# EAGLE schematic main (EAGLE 6.1)
ESKD_COPYRIGHT: 50|48|48|56|48|48; ESKD_DATE1: 51|49|46|49|50|46|50|48|49|48; ESKD_DESCRIPTION1: 210|229|240|236|238|241|242|224|242; ESKD_DESCRIPTION2: 241|245|229|236|224|32|253|235|229|234|242|240|232|247|229|241|234|224|255; ESKD_DESCRIPTION3: 239|240|232|237|246|232|239|232|224|235|252|237|224|255; ESKD_NUMBER: 192|193|194|195|32|49|57|52|48|48|48|46|48|48|49|32|221|51; ESKD_NUMBER_SHEET: 49; ESKD_SHEETS: 49
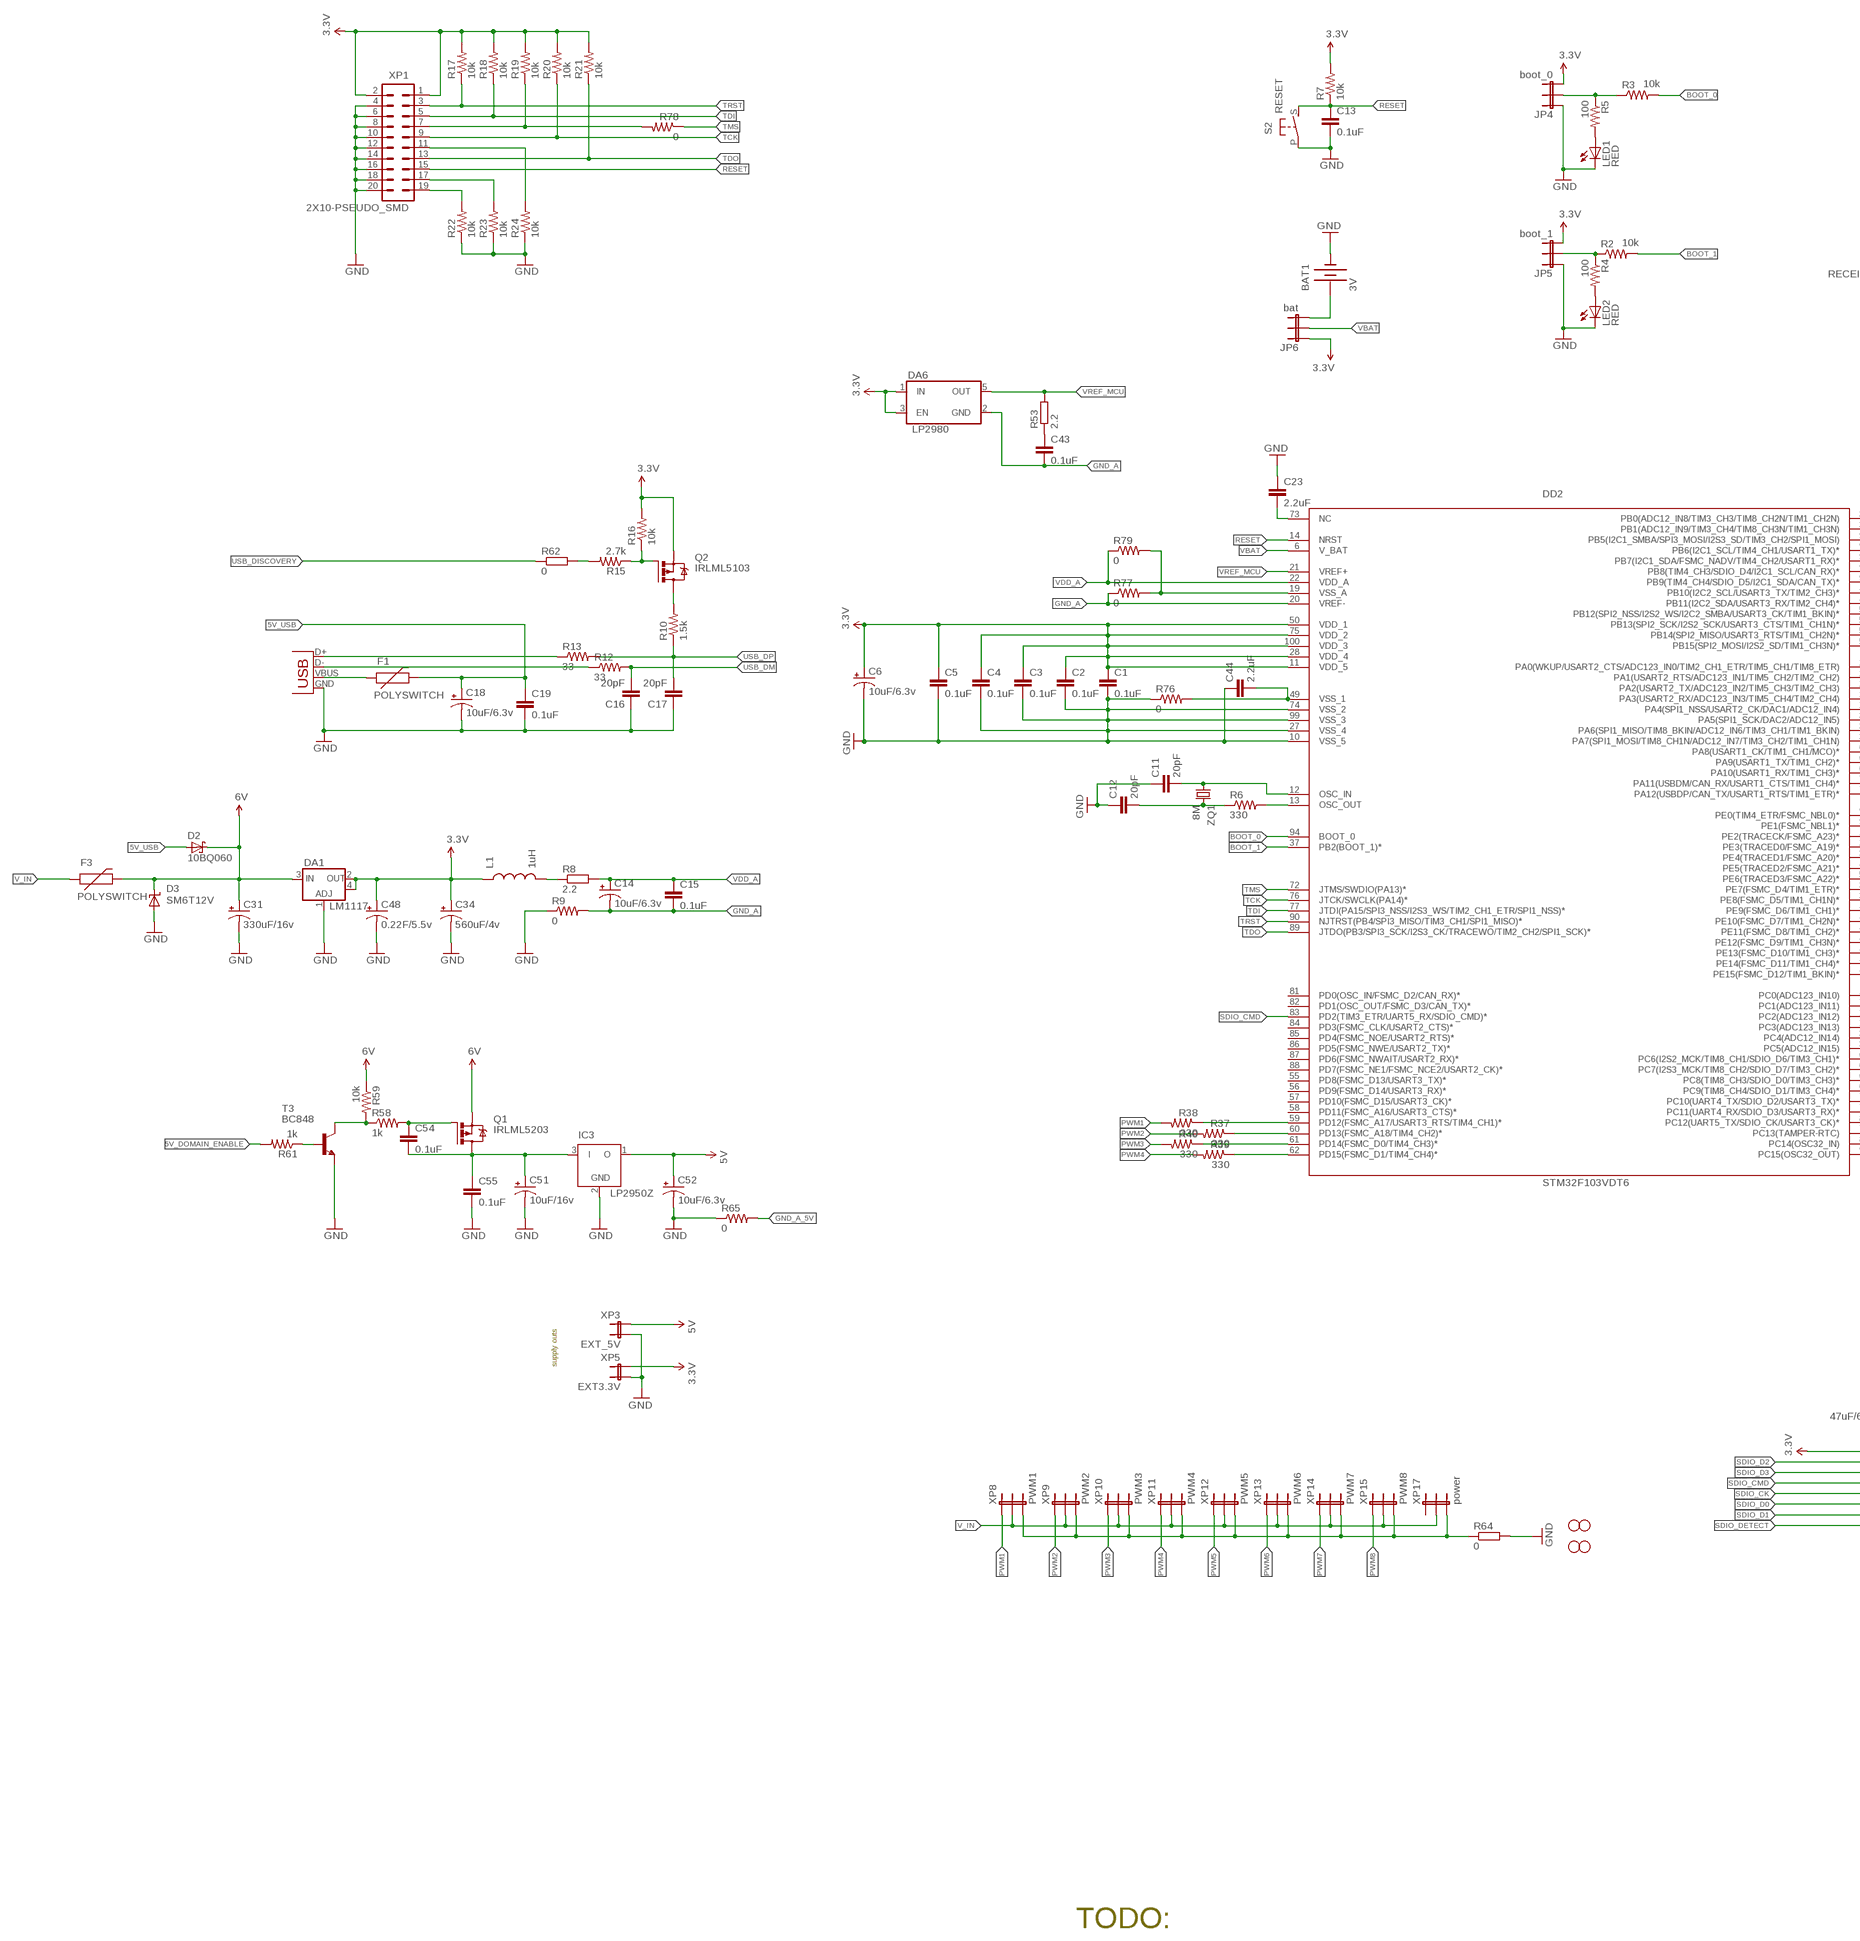
[diagram p0: schematic, sheet 1, part 1 of 3]
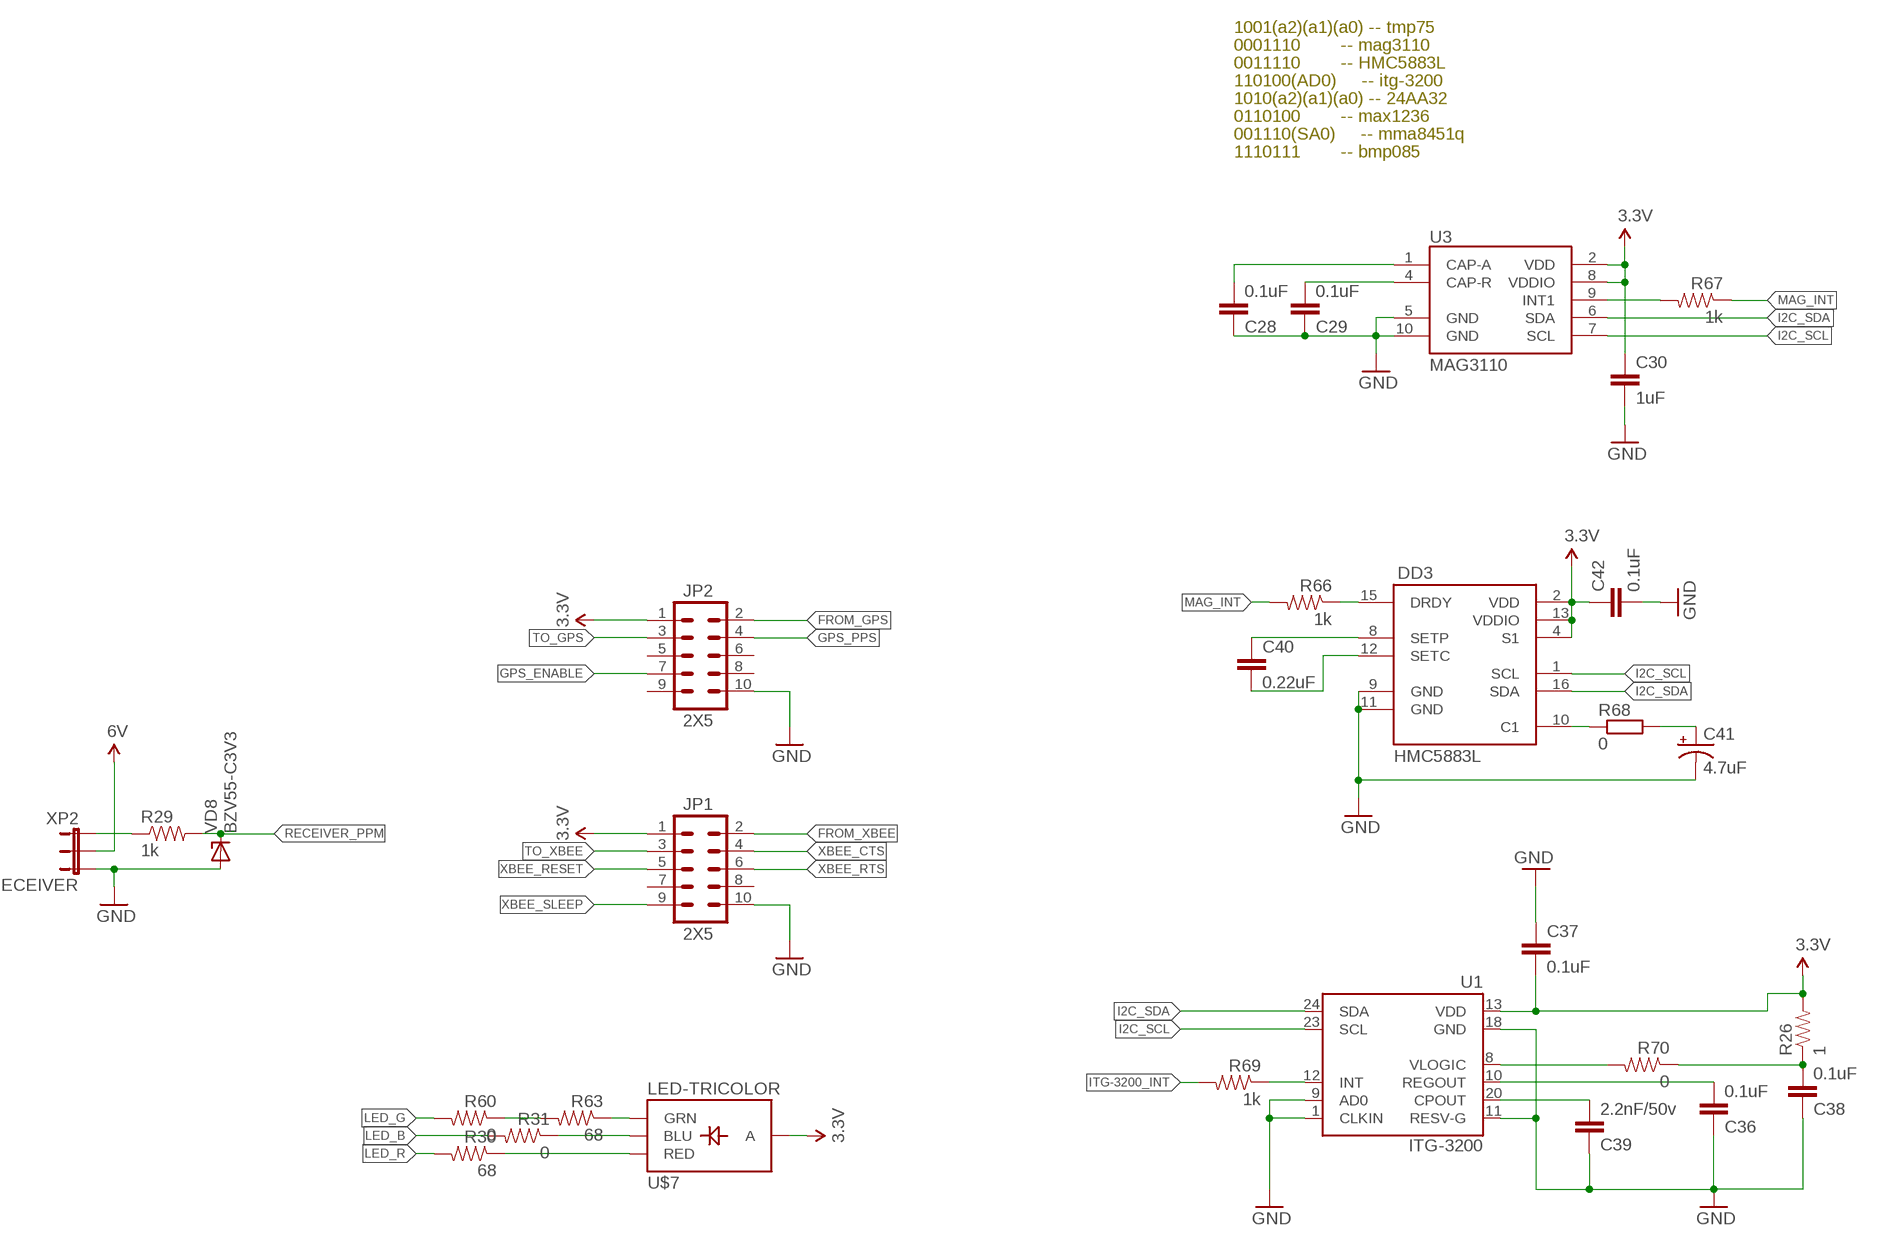
[diagram p1: schematic, sheet 1, part 2 of 3]
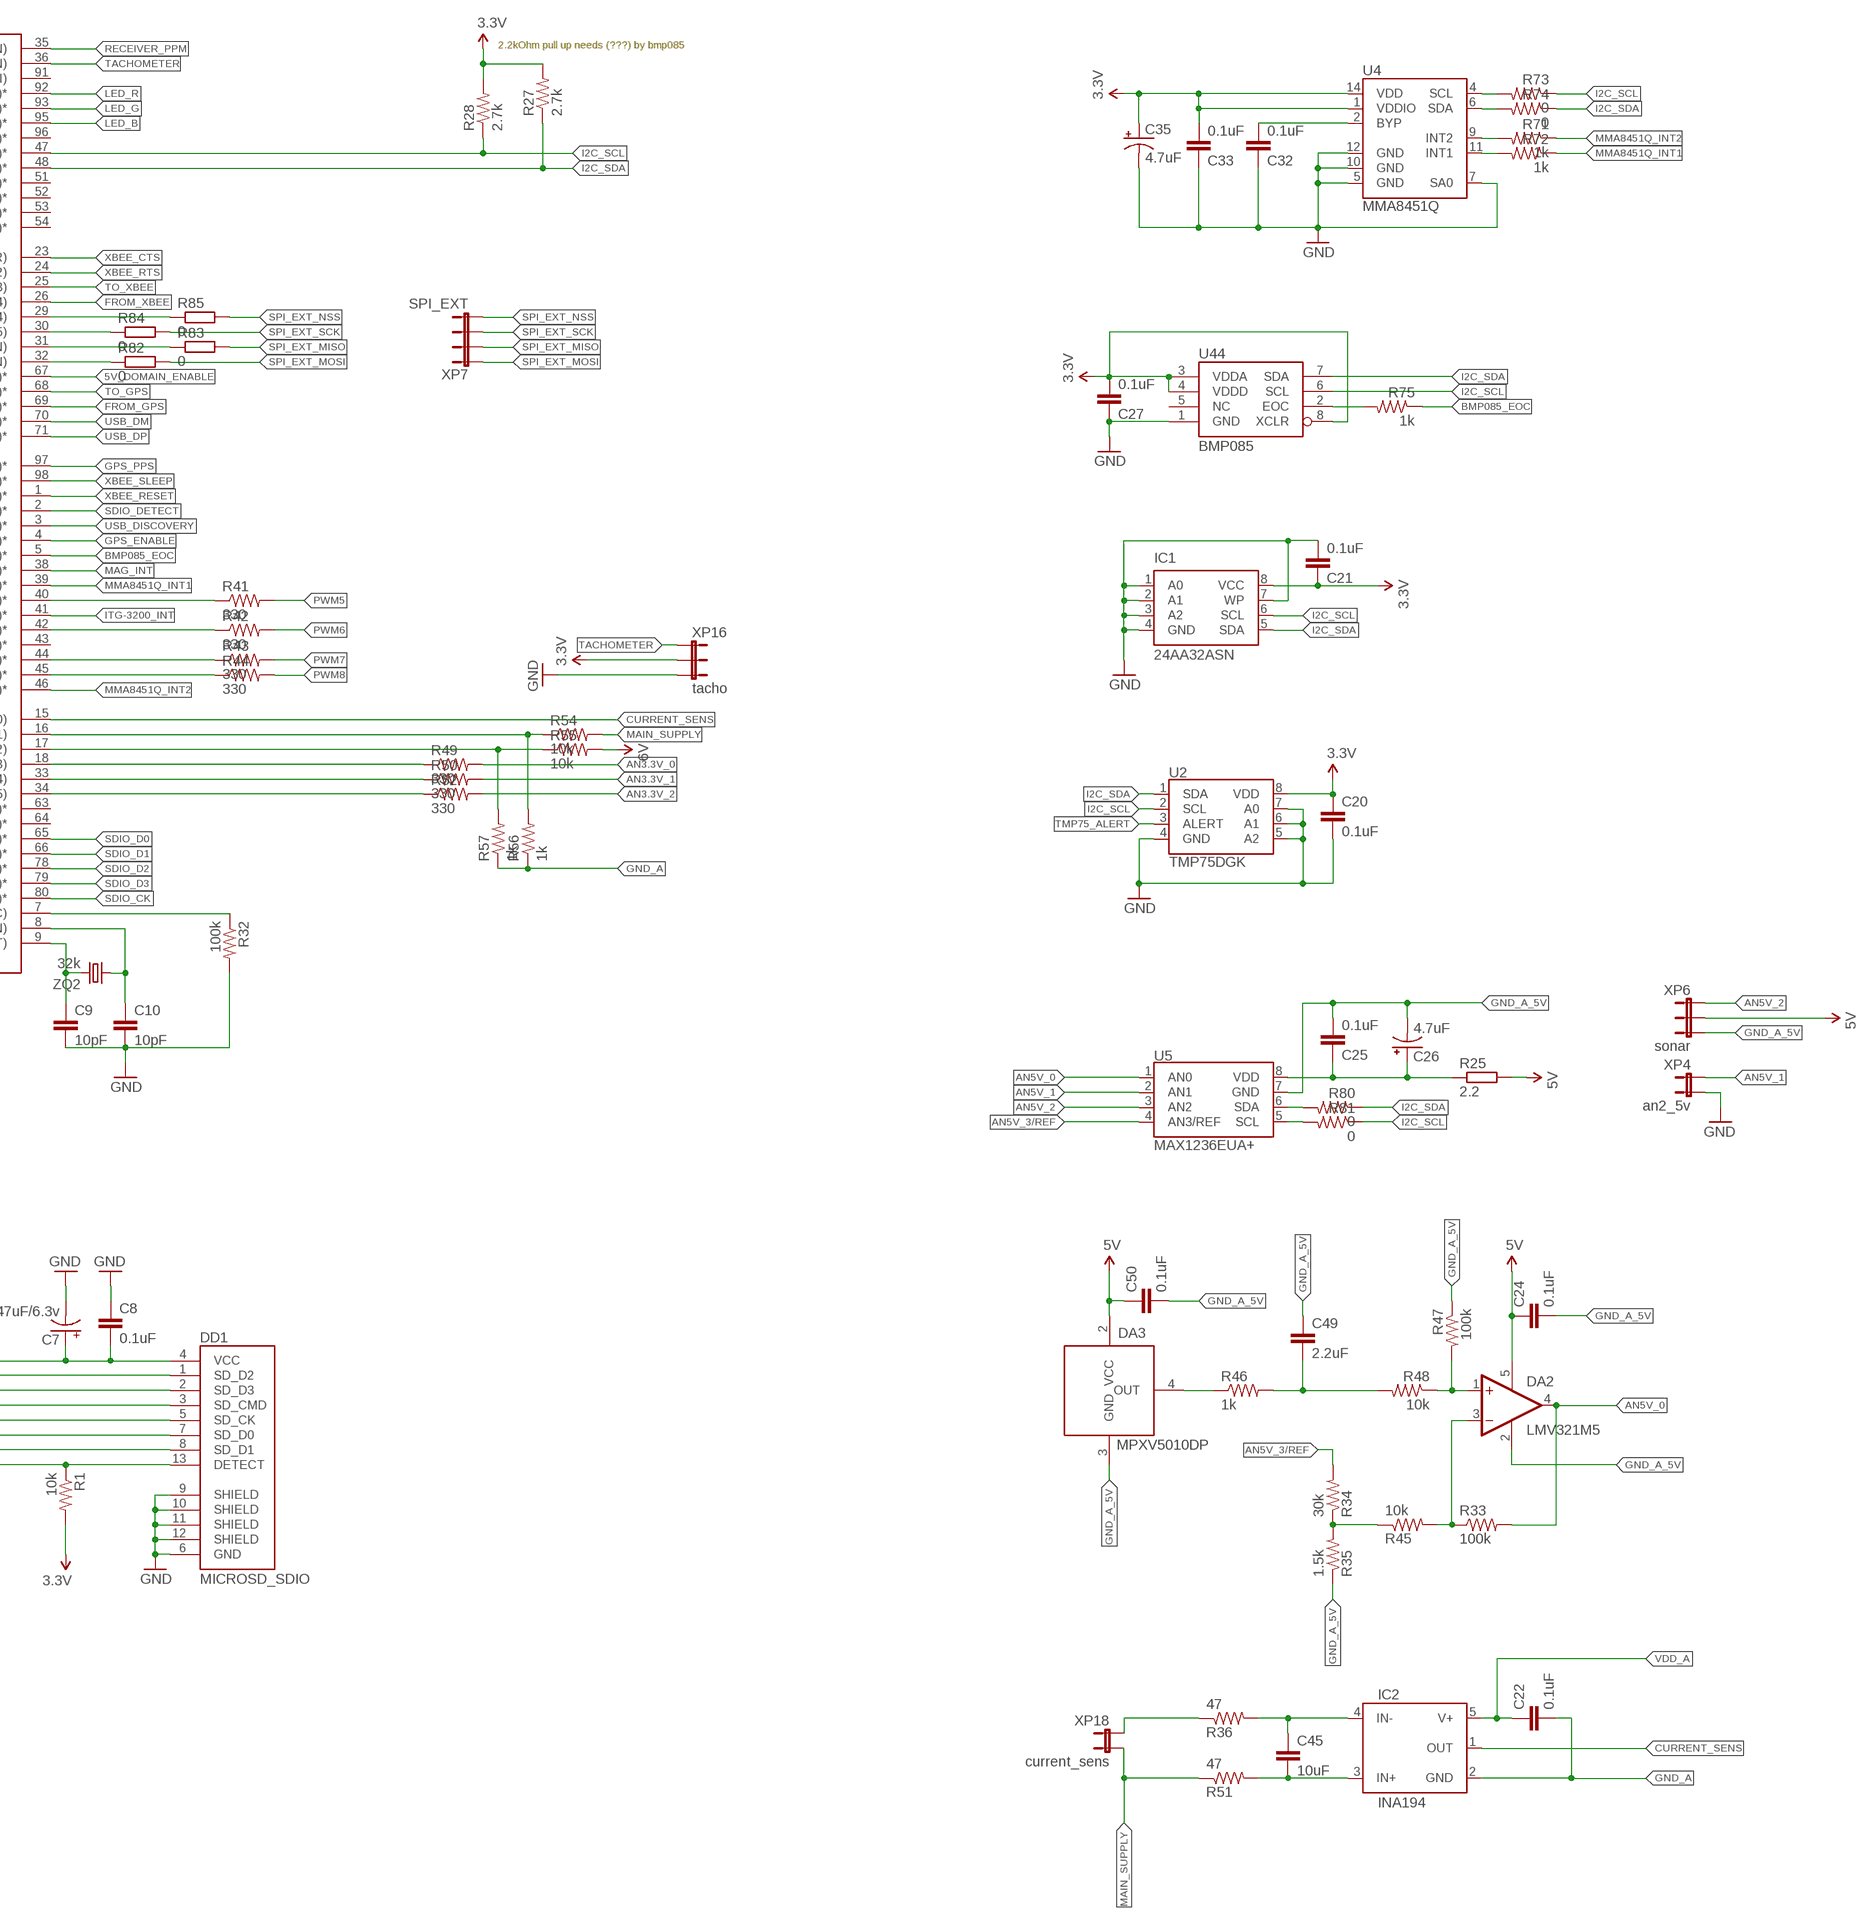
[diagram p2: schematic, sheet 1, part 3 of 3]

## Parts
BAT1  3V  BATTERY20PTH  [BATTCOM_20MM_PTH]
C1  0.1uF  CAP0805  [0805]
C2  0.1uF  CAP0805  [0805]
C3  0.1uF  CAP0805  [0805]
C4  0.1uF  CAP0805  [0805]
C5  0.1uF  CAP0805  [0805]
C6  10uF/6.3v  CAP_POL1206-KIT  [EIA3216-KIT]
C7  47uF/6.3v  CAP_POL1206-KIT  [EIA3216-KIT]
C8  0.1uF  CAP0805  [0805]
C9  10pF  CAP0805  [0805]
C10  10pF  CAP0805  [0805]
C11  20pF  CAP0805  [0805]
C12  20pF  CAP0805  [0805]
C13  0.1uF  CAP0805  [0805]
C14  10uF/6.3v  CAP_POL1206-KIT  [EIA3216-KIT]
C15  0.1uF  CAP0805  [0805]
C16  20pF  CAP0805  [0805]
C17  20pF  CAP0805  [0805]
C18  10uF/6.3v  CAP_POL1206-KIT  [EIA3216-KIT]
C19  0.1uF  CAP0805  [0805]
C20  0.1uF  CAP0805  [0805]
C21  0.1uF  CAP0805  [0805]
C22  0.1uF  CAP0805  [0805]
C23  2.2uF  CAP0805  [0805]
C24  0.1uF  CAP0805  [0805]
C25  0.1uF  CAP0805  [0805]
C26  4.7uF  CAP_POL1206-KIT  [EIA3216-KIT]
C27  0.1uF  CAP0805  [0805]
C28  0.1uF  CAP0805  [0805]
C29  0.1uF  CAP0805  [0805]
C30  1uF  CAP0805  [0805]
C31  330uF/16v  CAP_POLPTH4  [CPOL-RADIAL-1000UF-25V]
C32  0.1uF  CAP0805  [0805]
C33  0.1uF  CAP0805  [0805]
C34  560uF/4v  CPOL-USE3.5-8  [E3,5-8]
C35  4.7uF  CAP_POL1206-KIT  [EIA3216-KIT]
C36  0.1uF  CAP0805  [0805]
C37  0.1uF  CAP0805  [0805]
C38  0.1uF  CAP0805  [0805]
C39  2.2nF/50v  CAP0805  [0805]
C40  0.22uF  CAP0805  [0805]
C41  4.7uF  CAP_POL1206-KIT  [EIA3216-KIT]
C42  0.1uF  CAP0805  [0805]
C43  0.1uF  CAP0805  [0805]
C44  2.2uF  CAP0805  [0805]
C45  10uF  CAP1206  [1206]
C48  0.22F/5.5v  CAP_POLIONISTOR  [CAP-IONISTOR-5MM]
C49  2.2uF  C-EUC1206  [C1206]
C50  0.1uF  CAP0805  [0805]
C51  10uF/16v  CAP_POL1206-KIT  [EIA3216-KIT]
C52  10uF/6.3v  CAP_POL1206-KIT  [EIA3216-KIT]
C54  0.1uF  CAP0805  [0805]
C55  0.1uF  CAP0805  [0805]
D2  10BQ060  SCHOTTKY-DIODESMD  [SMB]
D3  SM6T12V  SUPPRESSOR-SMBJ  [SMBJ]
DA1  LM1117  [SOT223]
DA2  LMV321M5  [SOT23-5]
DA3  MPXV5010DP  [482]
DA6  LP2980  [SOT23-5]
DD1  MICROSD_SDIO  [MICROSD]
DD2  STM32F103VDT6  [TQFP100]
DD3  HMC5883L  [16LPCC]
F1  POLYSWITCH  [1812]
F3  POLYSWITCH  [1812]
IC1  24AA32ASN  [SO-08]
IC2  INA194  [SOT23-5]
IC3  LP2950Z  [TO92]
JP1  2X5  [2X5-PSEUDOSMD]
JP2  2X5  [2X5-PSEUDOSMD]
JP3  STAND-OFFTIGHT  [STAND-OFF-TIGHT]
JP4  boot_0  JUMPER-3PTH  [1X03]
JP5  boot_1  JUMPER-3PTH  [1X03]
JP6  bat  JUMPER-3PTH  [1X03]
JP7  STAND-OFFTIGHT  [STAND-OFF-TIGHT]
JP8  STAND-OFFTIGHT  [STAND-OFF-TIGHT]
JP9  STAND-OFFTIGHT  [STAND-OFF-TIGHT]
L1  1uH  INDUCTOR1210  [1210]
LED1  RED  LED0805  [LED-0805]
LED2  RED  LED0805  [LED-0805]
Q1  IRLML5203  [MICRO3]
Q2  IRLML5103  IRLML5203  [MICRO3]
R1  10k  RESISTOR0805-RES  [0805]
R2  10k  RESISTOR0805-RES  [0805]
R3  10k  RESISTOR0805-RES  [0805]
R4  100  RESISTOR0805-RES  [0805]
R5  100  RESISTOR0805-RES  [0805]
R6  330  RESISTOR0805-RES  [0805]
R7  10k  RESISTOR0805-RES  [0805]
R8  2.2  R-EU_R1206  [R1206]
R9  0  RESISTOR0805-RES  [0805]
R10  1.5k  RESISTOR0805-RES  [0805]
R12  33  RESISTOR0805-RES  [0805]
R13  33  RESISTOR0805-RES  [0805]
R15  2.7k  RESISTOR0805-RES  [0805]
R16  10k  RESISTOR0805-RES  [0805]
R17  10k  RESISTOR0805-RES  [0805]
R18  10k  RESISTOR0805-RES  [0805]
R19  10k  RESISTOR0805-RES  [0805]
R20  10k  RESISTOR0805-RES  [0805]
R21  10k  RESISTOR0805-RES  [0805]
R22  10k  RESISTOR0805-RES  [0805]
R23  10k  RESISTOR0805-RES  [0805]
R24  10k  RESISTOR0805-RES  [0805]
R25  2.2  RESISTOR1206  [R1206]
R26  1  RESISTOR0805-RES  [0805]
R27  2.7k  RESISTOR0805-RES  [0805]
R28  2.7k  RESISTOR0805-RES  [0805]
R29  1k  RESISTOR0805-RES  [0805]
R30  68  RESISTOR0805-RES  [0805]
R31  0  RESISTOR0805-RES  [0805]
R32  100k  RESISTOR0805-RES  [0805]
R33  100k  RESISTOR0805-RES  [0805]
R34  30k  RESISTOR0805-RES  [0805]
R35  1.5k  RESISTOR0805-RES  [0805]
R36  47  RESISTOR0805-RES  [0805]
R37  330  RESISTOR0805-RES  [0805]
R38  330  RESISTOR0805-RES  [0805]
R39  330  RESISTOR0805-RES  [0805]
R40  330  RESISTOR0805-RES  [0805]
R41  330  RESISTOR0805-RES  [0805]
R42  330  RESISTOR0805-RES  [0805]
R43  330  RESISTOR0805-RES  [0805]
R44  330  RESISTOR0805-RES  [0805]
R45  10k  RESISTOR0805-RES  [0805]
R46  1k  RESISTOR0805-RES  [0805]
R47  100k  RESISTOR0805-RES  [0805]
R48  10k  RESISTOR0805-RES  [0805]
R49  330  RESISTOR0805-RES  [0805]
R50  330  RESISTOR0805-RES  [0805]
R51  47  RESISTOR0805-RES  [0805]
R52  330  RESISTOR0805-RES  [0805]
R53  2.2  RESISTOR1206  [R1206]
R54  10k  RESISTOR0805-RES  [0805]
R55  10k  RESISTOR0805-RES  [0805]
R56  1k  RESISTOR0805-RES  [0805]
R57  1k  RESISTOR0805-RES  [0805]
R58  1k  RESISTOR0805-RES  [0805]
R59  10k  RESISTOR0805-RES  [0805]
R60  0  RESISTOR0805-RES  [0805]
R61  1k  RESISTOR0805-RES  [0805]
R62  0  RESISTOR1206  [R1206]
R63  68  RESISTOR0805-RES  [0805]
R64  0  RESISTOR1206  [R1206]
R65  0  RESISTOR0805-RES  [0805]
R66  1k  RESISTOR0805-RES  [0805]
R67  1k  RESISTOR0805-RES  [0805]
R68  0  RESISTOR1206  [R1206]
R69  1k  RESISTOR0805-RES  [0805]
R70  0  RESISTOR0805-RES  [0805]
R71  1k  RESISTOR0805-RES  [0805]
R72  1k  RESISTOR0805-RES  [0805]
R73  0  RESISTOR0805-RES  [0805]
R74  0  RESISTOR0805-RES  [0805]
R75  1k  RESISTOR0805-RES  [0805]
R76  0  RESISTOR0805-RES  [0805]
R77  0  RESISTOR0805-RES  [0805]
R78  0  RESISTOR0805-RES  [0805]
R79  0  RESISTOR0805-RES  [0805]
R80  0  RESISTOR0805-RES  [0805]
R81  0  RESISTOR0805-RES  [0805]
R82  0  RESISTOR1206  [R1206]
R83  0  RESISTOR1206  [R1206]
R84  0  RESISTOR1206  [R1206]
R85  0  RESISTOR1206  [R1206]
S2  RESET  BUTTON_6X3.5  [BUTTON_6X3.5]
T3  BC848  [SOT23]
U1  ITG-3200  [QFN-24]
U2  TMP75DGK  [MSOP8]
U3  MAG3110  [DFN-10]
U4  MMA8451Q  [QFN-16_0.5MM]
U5  MAX1236EUA+  [MSOP8]
U44  BMP085  [BMP085]
U$7  LED-TRICOLOR  [LED-TRICOLOR-SMD]
VD8  BZV55-C3V3  [SOD80C]
X1  USB-SMD-NS  [USB-MINIB-NOSTOP]
XP1  2X10-PSEUDO_SMD  [2X10-PSEUDOSMD]
XP2  RECEIVER  JUMPER-3PTH  [1X03]
XP3  EXT_5V  1X2DIP  [1X02]
XP4  an2_5v  1X2DIP  [1X02]
XP5  EXT3.3V  1X2DIP  [1X02]
XP6  sonar  JUMPER-3PTH  [1X03]
XP7  SPI_EXT  1X4  [1X4-PSEUDOSMD]
XP8  PWM1  JUMPER-3PTH  [1X03]
XP9  PWM2  JUMPER-3PTH  [1X03]
XP10  PWM3  JUMPER-3PTH  [1X03]
XP11  PWM4  JUMPER-3PTH  [1X03]
XP12  PWM5  JUMPER-3PTH  [1X03]
XP13  PWM6  JUMPER-3PTH  [1X03]
XP14  PWM7  JUMPER-3PTH  [1X03]
XP15  PWM8  JUMPER-3PTH  [1X03]
XP16  tacho  JUMPER-3PTH  [1X03]
XP17  power  JUMPER-3PTH  [1X03]
XP18  current_sens  1X2DIP  [1X02]
ZQ1  8M  CRYSTALHC49UV  [HC49U-V]
ZQ2  32k  CRYSTALTC38H  [TC38H]

## Nets
3.3V: C1.1 C2.1 C3.1 C4.1 C5.1 C6.A(+) C7.A(+) C8.2 C20.1 C21.1 C27.2 C30.1 C33.2 C34.+ C35.A(+) C37.2 C42.1 C48.1(+) DA1.2(OUT) DA1.4(OUT) DA6.1(IN) DA6.3(EN) DD1.4(VCC) DD2.11(VDD_5) DD2.28(VDD_4) DD2.50(VDD_1) DD2.75(VDD_2) DD2.100(VDD_3) DD3.2(VDD) DD3.4(S1) DD3.13(VDDIO) IC1.8(VCC) JP1.1 JP2.1 JP4.3 JP5.3 JP6.1 L1.1 Q2.2(S) R1.2 R7.2 R16.2 R17.2 R18.2 R19.2 R20.2 R21.2 R26.2 R27.2 R28.2 U1.13(VDD) U2.8(VDD) U3.2(VDD) U3.8(VDDIO) U4.1(VDDIO) U4.14(VDD) U44.3(VDDA) U44.4(VDDD) U44.8(XCLR) U$7.A XP1.1 XP1.2 XP5.1 XP16.2
5V: C24.1 C50.1 C52.A(+) DA2.5(V+) DA3.2(VCC) IC3.1(O) R25.2 XP3.1 XP6.2
5V_DOMAIN_ENABLE: DD2.67(PA8(USART1_CK/TIM1_CH1/MCO)*) R61.2
5V_USB: C18.A(+) C19.1 D2.A F1.2
6V: C31.1(+) D2.C D3.C DA1.3(IN) F3.2 Q1.2(S) R55.2 R59.1 XP2.2
AN3.3V_0: R49.2
AN3.3V_1: R50.2
AN3.3V_2: R52.2
AN5V_0: DA2.4(OUT) R33.2 U5.1(AN0)
AN5V_1: U5.2(AN1) XP4.1
AN5V_2: U5.3(AN2) XP6.1
AN5V_3/REF: R34.2 U5.4(AN3/REF)
BMP085_EOC: DD2.5(PE6(TRACED3/FSMC_A22)*) R75.1
BOOT_0: DD2.94(BOOT_0) R3.2
BOOT_1: DD2.37(PB2(BOOT_1)*) R2.2
CURRENT_SENS: DD2.15(PC0(ADC123_IN10)) IC2.1(OUT)
FROM_GPS: DD2.69(PA10(USART1_RX/TIM1_CH3)*) JP2.2
FROM_XBEE: DD2.26(PA3(USART2_RX/ADC123_IN3/TIM5_CH4/TIM2_CH4)) JP1.2
GND: BAT1.2(-) C1.2 C2.2 C3.2 C4.2 C5.2 C6.C(-) C7.C(-) C8.1 C9.2 C10.2 C11.1 C12.1 C13.2 C16.1 C17.1 C18.C(-) C19.2 C20.2 C21.2 C23.1 C27.1 C28.1 C29.1 C30.2 C31.2(-) C32.1 C33.1 C34.- C35.C(-) C36.1 C37.1 C38.1 C39.1 C41.C(-) C42.2 C44.1 C48.2(-) C51.C(-) C52.C(-) C55.2 D3.A DA1.1(ADJ) DD1.6(GND) DD1.9(SHIELD) DD1.10(SHIELD) DD1.11(SHIELD) DD1.12(SHIELD) DD2.10(VSS_5) DD2.27(VSS_4) DD2.74(VSS_2) DD2.99(VSS_3) DD3.9(GND) DD3.11(GND) IC1.1(A0) IC1.2(A1) IC1.3(A2) IC1.4(GND) IC1.7(WP) IC3.2(GND) JP1.10 JP2.10 JP4.1 JP5.1 LED1.C LED2.C R9.1 R22.1 R23.1 R24.1 R32.2 R64.2 R65.1 R76.1 S2.P T3.2(E) U1.1(CLKIN) U1.9(AD0) U1.11(RESV-G) U1.18(GND) U2.4(GND) U2.5(A2) U2.6(A1) U2.7(A0) U3.5(GND) U3.10(GND) U4.5(GND) U4.7(SA0) U4.10(GND) U4.12(GND) U44.1(GND) VD8.A X1.GND XP1.4 XP1.6 XP1.8 XP1.10 XP1.12 XP1.14 XP1.16 XP1.18 XP1.20 XP2.3 XP3.2 XP4.2 XP5.2 XP16.3
GND_A: C14.C(-) C15.2 C22.2 C43.2 DA6.2(GND) DD2.20(VREF-) IC2.2(GND) R9.2 R56.1 R57.1 R77.1
GND_A_5V: C24.2 C25.2 C26.C(-) C49.1 C50.2 DA2.2(V-) DA3.3(GND) R35.1 R47.1 R65.2 U5.7(GND) XP6.3
GPS_ENABLE: DD2.4(PE5(TRACED2/FSMC_A21)*) JP2.7
GPS_PPS: DD2.97(PE0(TIM4_ETR/FSMC_NBL0)*) JP2.4
I2C_SCL: DD2.47(PB10(I2C2_SCL/USART3_TX/TIM2_CH3)*) DD3.1(SCL) IC1.6(SCL) R28.1 R73.1 R81.1 U1.23(SCL) U2.2(SCL) U3.7(SCL) U44.6(SCL)
I2C_SDA: DD2.48(PB11(I2C2_SDA/USART3_RX/TIM2_CH4)*) DD3.16(SDA) IC1.5(SDA) R27.1 R74.1 R80.1 U1.24(SDA) U2.1(SDA) U3.6(SDA) U44.7(SDA)
ITG-3200_INT: DD2.41(PE10(FSMC_D7/TIM1_CH2N)*) R69.2
LED_B: DD2.95(PB8(TIM4_CH3/SDIO_D4/I2C1_SCL/CAN_RX)*) R31.2
LED_G: DD2.93(PB7(I2C1_SDA/FSMC_NADV/TIM4_CH2/USART1_RX)*) R60.2
LED_R: DD2.92(PB6(I2C1_SCL/TIM4_CH1/USART1_TX)*) R30.2
MAG_INT: DD2.38(PE7(FSMC_D4/TIM1_ETR)*) R66.2 R67.1
MAIN_SUPPLY: R51.1 R54.2 XP18.2
MMA8451Q_INT1: DD2.39(PE8(FSMC_D5/TIM1_CH1N)*) R72.1
MMA8451Q_INT2: DD2.46(PE15(FSMC_D12/TIM1_BKIN)*) R71.1
N$1: C9.1 DD2.9(PC15(OSC32_OUT)) ZQ2.2
N$2: LED2.A R4.2
N$3: JP5.2 R2.1 R4.1
N$4: LED1.A R5.2
N$5: JP4.2 R3.1 R5.1
N$6: C10.1 DD2.8(PC14(OSC32_IN)) ZQ2.1
N$7: DD2.13(OSC_OUT) R6.2
N$8: C12.2 R6.1 ZQ1.2
N$9: C11.2 DD2.12(OSC_IN) ZQ1.1
N$10: R12.1 X1.D-
N$11: BAT1.1(+) JP6.3
N$12: L1.2 R8.1
N$13: R13.1 X1.D+
N$14: Q2.3(D) R10.2
N$16: Q2.1(G) R15.1 R16.1
N$17: R22.2 XP1.19
N$18: R23.2 XP1.17
N$19: R24.2 XP1.11
N$20: C45.1 IC2.4(IN-) R36.2
N$21: C25.1 C26.A(+) R25.1 U5.8(VDD)
N$22: C32.2 U4.2(BYP)
N$23: C36.2 U1.10(REGOUT)
N$24: C29.2 U3.4(CAP-R)
N$25: C38.2 R26.1 R70.1
N$26: C28.2 U3.1(CAP-A)
N$27: C40.1 DD3.8(SETP)
N$28: C40.2 DD3.12(SETC)
N$29: F1.1 X1.VBUS
N$30: C39.2 U1.20(CPOUT)
N$31: C41.A(+) R68.2
N$32: R29.1 XP2.1
N$33: R63.1 U$7.G(GRN)
N$34: DD2.7(PC13(TAMPER-RTC)) R32.1
N$35: C49.2 R46.2 R48.2
N$36: DD2.32(PA7(SPI1_MOSI/TIM8_CH1N/ADC12_IN7/TIM3_CH2/TIM1_CH1N)) R82.1
N$37: C45.2 IC2.3(IN+) R51.2
N$38: C43.1 R53.1
N$39: R36.1 XP18.1
N$40: DD2.62(PD15(FSMC_D1/TIM4_CH4)*) R39.1
N$41: DD2.61(PD14(FSMC_D0/TIM4_CH3)*) R40.1
N$42: DD2.60(PD13(FSMC_A18/TIM4_CH2)*) R37.1
N$43: DD2.59(PD12(FSMC_A17/USART3_RTS/TIM4_CH1)*) R38.1
N$44: DA3.4(OUT) R46.1
N$45: DD2.34(PC5(ADC12_IN15)) R52.1
N$46: DA2.3(-IN) R33.1 R45.2
N$47: DA2.1(+IN) R47.2 R48.1
N$48: R34.1 R35.2 R45.1
N$49: DD2.33(PC4(ADC12_IN14)) R50.1
N$50: DD2.18(PC3(ADC123_IN13)) R49.1
N$51: DD2.31(PA6(SPI1_MISO/TIM8_BKIN/ADC12_IN6/TIM3_CH1/TIM1_BKIN)) R83.1
N$52: DD2.16(PC1(ADC123_IN11)) R54.1 R56.2
N$53: C54.1 Q1.1(G) R58.2
N$54: DD2.17(PC2(ADC123_IN12)) R55.1 R57.2
N$55: C51.A(+) C54.2 C55.1 IC3.3(I) Q1.3(D)
N$56: R31.1 U$7.B(BLU)
N$57: R30.1 U$7.R(RED)
N$58: DD2.30(PA5(SPI1_SCK/DAC2/ADC12_IN5)) R84.1
N$59: R61.1 T3.1(B)
N$60: DD2.29(PA4(SPI1_NSS/USART2_CK/DAC1/ADC12_IN4)) R85.1
N$61: DD2.45(PE14(FSMC_D11/TIM1_CH4)*) R44.1
N$62: DD2.44(PE13(FSMC_D10/TIM1_CH3)*) R43.1
N$63: DD2.42(PE11(FSMC_D8/TIM1_CH2)*) R42.1
N$64: DD2.40(PE9(FSMC_D6/TIM1_CH1)*) R41.1
N$65: R67.2 U3.9(INT1)
N$66: DD3.15(DRDY) R66.1
N$67: DD3.10(C1) R68.1
N$68: R69.1 U1.12(INT)
N$69: R70.2 U1.8(VLOGIC)
N$70: R71.2 U4.9(INT2)
N$71: R72.2 U4.11(INT1)
N$72: R74.2 U4.6(SDA)
N$73: R73.2 U4.4(SCL)
N$74: R75.2 U44.2(EOC)
N$75: R15.2 R62.2
N$76: R60.1 R63.2
N$77: R19.1 R78.2 XP1.7
N$78: R64.1 XP8.3 XP9.3 XP10.3 XP11.3 XP12.3 XP13.3 XP14.3 XP15.3 XP17.3
N$79: R80.2 U5.6(SDA)
N$80: R81.2 U5.5(SCL)
N$81: C23.2 DD2.73(NC)
N$82: C44.2 DD2.49(VSS_1) R76.2
N$83: DD2.19(VSS_A) R77.2 R79.2
NET$1: R58.1 R59.2 T3.3(C)
PWM1: R38.2 XP8.1
PWM2: R37.2 XP9.1
PWM3: R40.2 XP10.1
PWM4: R39.2 XP11.1
PWM5: R41.2 XP12.1
PWM6: R42.2 XP13.1
PWM7: R43.2 XP14.1
PWM8: R44.2 XP15.1
RECEIVER_PPM: DD2.35(PB0(ADC12_IN8/TIM3_CH3/TIM8_CH2N/TIM1_CH2N)) R29.2 VD8.C
RESET: C13.1 DD2.14(NRST) R7.1 S2.S XP1.15
SDIO_CK: DD1.5(SD_CK) DD2.80(PC12(UART5_TX/SDIO_CK/USART3_CK)*)
SDIO_CMD: DD1.3(SD_CMD) DD2.83(PD2(TIM3_ETR/UART5_RX/SDIO_CMD)*)
SDIO_D0: DD1.7(SD_D0) DD2.65(PC8(TIM8_CH3/SDIO_D0/TIM3_CH3)*)
SDIO_D1: DD1.8(SD_D1) DD2.66(PC9(TIM8_CH4/SDIO_D1/TIM3_CH4)*)
SDIO_D2: DD1.1(SD_D2) DD2.78(PC10(UART4_TX/SDIO_D2/USART3_TX)*)
SDIO_D3: DD1.2(SD_D3) DD2.79(PC11(UART4_RX/SDIO_D3/USART3_RX)*)
SDIO_DETECT: DD1.13(DETECT) DD2.2(PE3(TRACED0/FSMC_A19)*) R1.1
SPI_EXT_MISO: R83.2 XP7.2
SPI_EXT_MOSI: R82.2 XP7.1
SPI_EXT_NSS: R85.2 XP7.4
SPI_EXT_SCK: R84.2 XP7.3
TACHOMETER: DD2.36(PB1(ADC12_IN9/TIM3_CH4/TIM8_CH3N/TIM1_CH3N)) XP16.1
TCK: DD2.76(JTCK/SWCLK(PA14)*) R20.1 XP1.9
TDI: DD2.77(JTDI(PA15/SPI3_NSS/I2S3_WS/TIM2_CH1_ETR/SPI1_NSS)*) R18.1 XP1.5
TDO: DD2.89(JTDO(PB3/SPI3_SCK/I2S3_CK/TRACEWO/TIM2_CH2/SPI1_SCK)*) R21.1 XP1.13
TMP75_ALERT: U2.3(ALERT)
TMS: DD2.72(JTMS/SWDIO(PA13)*) R78.1
TO_GPS: DD2.68(PA9(USART1_TX/TIM1_CH2)*) JP2.3
TO_XBEE: DD2.25(PA2(USART2_TX/ADC123_IN2/TIM5_CH3/TIM2_CH3)) JP1.3
TRST: DD2.90(NJTRST(PB4/SPI3_MISO/TIM3_CH1/SPI1_MISO)*) R17.1 XP1.3
USB_DISCOVERY: DD2.3(PE4(TRACED1/FSMC_A20)*) R62.1
USB_DM: C16.2 DD2.70(PA11(USBDM/CAN_RX/USART1_CTS/TIM1_CH4)*) R12.2
USB_DP: C17.2 DD2.71(PA12(USBDP/CAN_TX/USART1_RTS/TIM1_ETR)*) R10.1 R13.2
V_IN: F3.1 XP8.2 XP9.2 XP10.2 XP11.2 XP12.2 XP13.2 XP14.2 XP15.2 XP17.2
VBAT: DD2.6(V_BAT) JP6.2
VDD_A: C14.A(+) C15.1 C22.1 DD2.22(VDD_A) IC2.5(V+) R8.2 R79.1
VREF_MCU: DA6.5(OUT) DD2.21(VREF+) R53.2
XBEE_CTS: DD2.23(PA0(WKUP/USART2_CTS/ADC123_IN0/TIM2_CH1_ETR/TIM5_CH1/TIM8_ETR)) JP1.4
XBEE_RESET: DD2.1(PE2(TRACECK/FSMC_A23)*) JP1.5
XBEE_RTS: DD2.24(PA1(USART2_RTS/ADC123_IN1/TIM5_CH2/TIM2_CH2)) JP1.6
XBEE_SLEEP: DD2.98(PE1(FSMC_NBL1)*) JP1.9
Unconnected: DD2.43(PE12(FSMC_D9/TIM1_CH3N)*) DD2.51(PB12(SPI2_NSS/I2S2_WS/I2C2_SMBA/USART3_CK/TIM1_BKIN)*) DD2.52(PB13(SPI2_SCK/I2S2_SCK/USART3_CTS/TIM1_CH1N)*) DD2.53(PB14(SPI2_MISO/USART3_RTS/TIM1_CH2N)*) DD2.54(PB15(SPI2_MOSI/I2S2_SD/TIM1_CH3N)*) DD2.55(PD8(FSMC_D13/USART3_TX)*) DD2.56(PD9(FSMC_D14/USART3_RX)*) DD2.57(PD10(FSMC_D15/USART3_CK)*) DD2.58(PD11(FSMC_A16/USART3_CTS)*) DD2.63(PC6(I2S2_MCK/TIM8_CH1/SDIO_D6/TIM3_CH1)*) DD2.64(PC7(I2S3_MCK/TIM8_CH2/SDIO_D7/TIM3_CH2)*) DD2.81(PD0(OSC_IN/FSMC_D2/CAN_RX)*) DD2.82(PD1(OSC_OUT/FSMC_D3/CAN_TX)*) DD2.84(PD3(FSMC_CLK/USART2_CTS)*) DD2.85(PD4(FSMC_NOE/USART2_RTS)*) DD2.86(PD5(FSMC_NWE/USART2_TX)*) DD2.87(PD6(FSMC_NWAIT/USART2_RX)*) DD2.88(PD7(FSMC_NE1/FSMC_NCE2/USART2_CK)*) DD2.91(PB5(I2C1_SMBA/SPI3_MOSI/I2S3_SD/TIM3_CH2/SPI1_MOSI)) DD2.96(PB9(TIM4_CH4/SDIO_D5/I2C1_SDA/CAN_TX)*) JP1.7 JP1.8 JP2.5 JP2.6 JP2.8 JP2.9 U44.5(NC) XP17.1

## Notes on the sheet
- 1001(a2)(a1)(a0) -- tmp75
- 0001110        -- mag3110
- 0011110        -- HMC5883L
- 110100(AD0)     -- itg-3200
- 1010(a2)(a1)(a0) -- 24AA32
- 0110100        -- max1236
- 001110(SA0)     -- mma8451q
- 1110111        -- bmp085
- 2.2kOhm pull up needs (???) by bmp085
- supply outs
- TODO:

## Library data of the parts
BAT1 = SparkFun:BATTERY: Battery Holders Various common sizes : AA, AAA, 20mm coin cell and 12mm coin cell.
C1-C5 C8-C13 C15-C17 C19-C25 C27-C30 C32 C33 C36-C40 C42-C45 C50 C54 C55 = SparkFun:CAP: Capacitor Standard 0603 ceramic capacitor, and 0.1" leaded capacitor.
C6 C7 C14 C18 C26 C31 C35 C41 C51 C52 = SparkFun:CAP_POL: Capacitor Polarized These are standard SMD and PTH capacitors. Normally 10uF, 47uF, and 100uF in electrolytic and tantalum varieties. Always verify the external diameter of the through hole cap, it varies with capacity, voltage, and manufacturer. The EIA devices should be standard.
C34 = rcl:CPOL-US: POLARIZED CAPACITOR, American symbol
C48 = barthess:CAP_POL: Capacitor Polarized These are standard SMD and PTH capacitors. Normally 10uF, 47uF, and 100uF in electrolytic and tantalum varieties. Always verify the external diameter of the through hole cap, it varies with capacity, voltage, and manufacturer. The EIA devices should be standard.
C49 = rcl:C-EU: CAPACITOR, European symbol
D2 = diode:SCHOTTKY-DIODE: Schottky Diode
D3 = diode:SUPPRESSOR-: Suppressor diode
DA1 = barthess:LM1117: Voltage Regulator LM1117 Standard adjustable voltage regulator but in SMD form. Spark Fun Electronics SKU : COM-00595
DA2 = linear:LMV321?*: General Purpose, Low Voltage, Rail-to-Rail Output Operational Amplifiers Source: http://www.national.com/mpf/LM/LMV321.html http://www.national.com/dt/lmv_qual.pdf
DA3 = barthess:MPXV5010DP
DA6 = barthess:LP2980
DD1 = barthess:MICROSD_SDIO: microSD Socket Push-push type uSD socket. Schematic element for SDIO pin names.
DD2 = barthess:STM32F103VDT6
DD3 = barthess:HMC5883L: 3 Axis Digital Compass IC
F1 F3 = barthess:POLYSWITCH: Resettable Fuse PTC Resettable Fuse. Spark Fun Electronics SKU : COM-08357
IC1 = barthess:24*: Serial EEPROM I2C; MF: MICROCHIP; MPN: 24AA32A-I/SN; OC_FARNELL: 1617659; OC_NEWARK: 83C5815
IC2 = barthess:INA194: High-Side Measurement Current Shunt Monitor; MF: TEXAS INSTRUMENTS; MPN: INA168NA/250; OC_FARNELL: 4375737; OC_NEWARK: 35C1744
IC3 = linear:LP2950: 100 mA, Low Power Low Dropout Voltage Regulator Source: http://www.onsemi.com/pub/Collateral/LP2950-D.PDF
JP1 JP2 = barthess:2X5: Standard 2x5 header.
JP3 JP7-JP9 = SparkFun:STAND-OFF: Stand Off This is the mechanical footprint for a #4 phillips button head screw. Use the keepout ring to avoid running the screw head into surrounding components. SKU : PRT-00447
JP4-JP6 XP2 XP6 XP8-XP17 = SparkFun:JUMPER-3
L1 = SparkFun:INDUCTOR: Inductors Basic Inductor/Choke - 0603 and 1206. Footprints are not proven and vary greatly between part numbers.
LED1 LED2 = barthess:LED: LEDs Standard schematic elements and footprints for 5mm, 3mm, 1206, and 0603 sized LEDs. 5mm - Spark Fun Electronics SKU : COM-00529 (and others)
Q1 = transistor-power:IRLML5203: HEXFET P-Channel Power MOSFET
Q2 = transistor-power:IRLML5203: HEXFET P-Channel Power MOSFET; PARTNO: *
R1-R7 R9 R10 R12 R13 R15-R24 R26-R52 R54-R61 R63 R65-R67 R69-R81 = SparkFun:RESISTOR: Resistor Basic schematic elements and footprints for 0603, 1206, and PTH resistors.
R8 = rcl:R-EU_: RESISTOR, European symbol
R25 R53 R62 R64 R68 R82-R85 = barthess:RESISTOR: Resistor Basic schematic elements and footprints for 0603, 1206, and PTH resistors.
S2 = barthess:BUTTON_6X3.5: OMRON SWITCH
T3 = transistor:BC848: NPN TRANSISTOR
U1 = barthess:ITG-3200: ITG-3200 3-axis gyro, digital output, qfn24 package
U2 = barthess:TMP75
U3 = barthess:MAG3110: 3-axis digital (I2C) magnetometer
U4 = barthess:MMA8451Q: MMA8452Q 3-Axis, 12/8-bit Digital Accelerometer Supply Voltage: 1.6-3.6V Range: +/- 2g, 4g, 8g Interface: I2C, 12-bit and 8-bit ODR: 1.56 Hz - 800 Hz Package: QFN-16 http://cache.freescale.com/files/sensors/doc/data_sheet/MMA8452Q.pdf
U5 = barthess:MAX1236
U44 = barthess:BMP085: BMP085 Pressure Sensor Great little MEMS pressure sensor. SKU: COM-09603
U$7 = SparkFun:LED-TRICOLOR: Tri-Color LED SMD Proven layout and schematic for triple color LED in SMD package - common anode. Spark Fun Electronics SKU : COM-07844
VD8 = barthess:BZV55: DIODE high speed
X1 = SparkFun:USB: USB Connectors USB-B-PTH is fully proven SKU : PRT-00139 USB-miniB is fully proven SKU : PRT-00587 USB-A-PCB is untested. USB-A-H is throughly reviewed, but untested. Spark Fun Electronics SKU : PRT-00437 USB-B-SMT is throughly reviewed, but untested. Needs silkscreen touching up. USB-A-S has not been used/tested USB-MB-H has not been used/tested
XP1 = barthess:2X10: Standard 10x2 JTAG header for ARM.
XP3-XP5 XP18 = barthess:1X2: Standard 1x2 header.
XP7 = barthess:1X4: Standard 1x4 header.
ZQ1 ZQ2 = barthess:CRYSTAL: Crystals Various standard crystals. Proven footprints. Spark Fun Electronics SKU : COM-00534